# Altium schematic sheet main_board.SchDoc
size A3
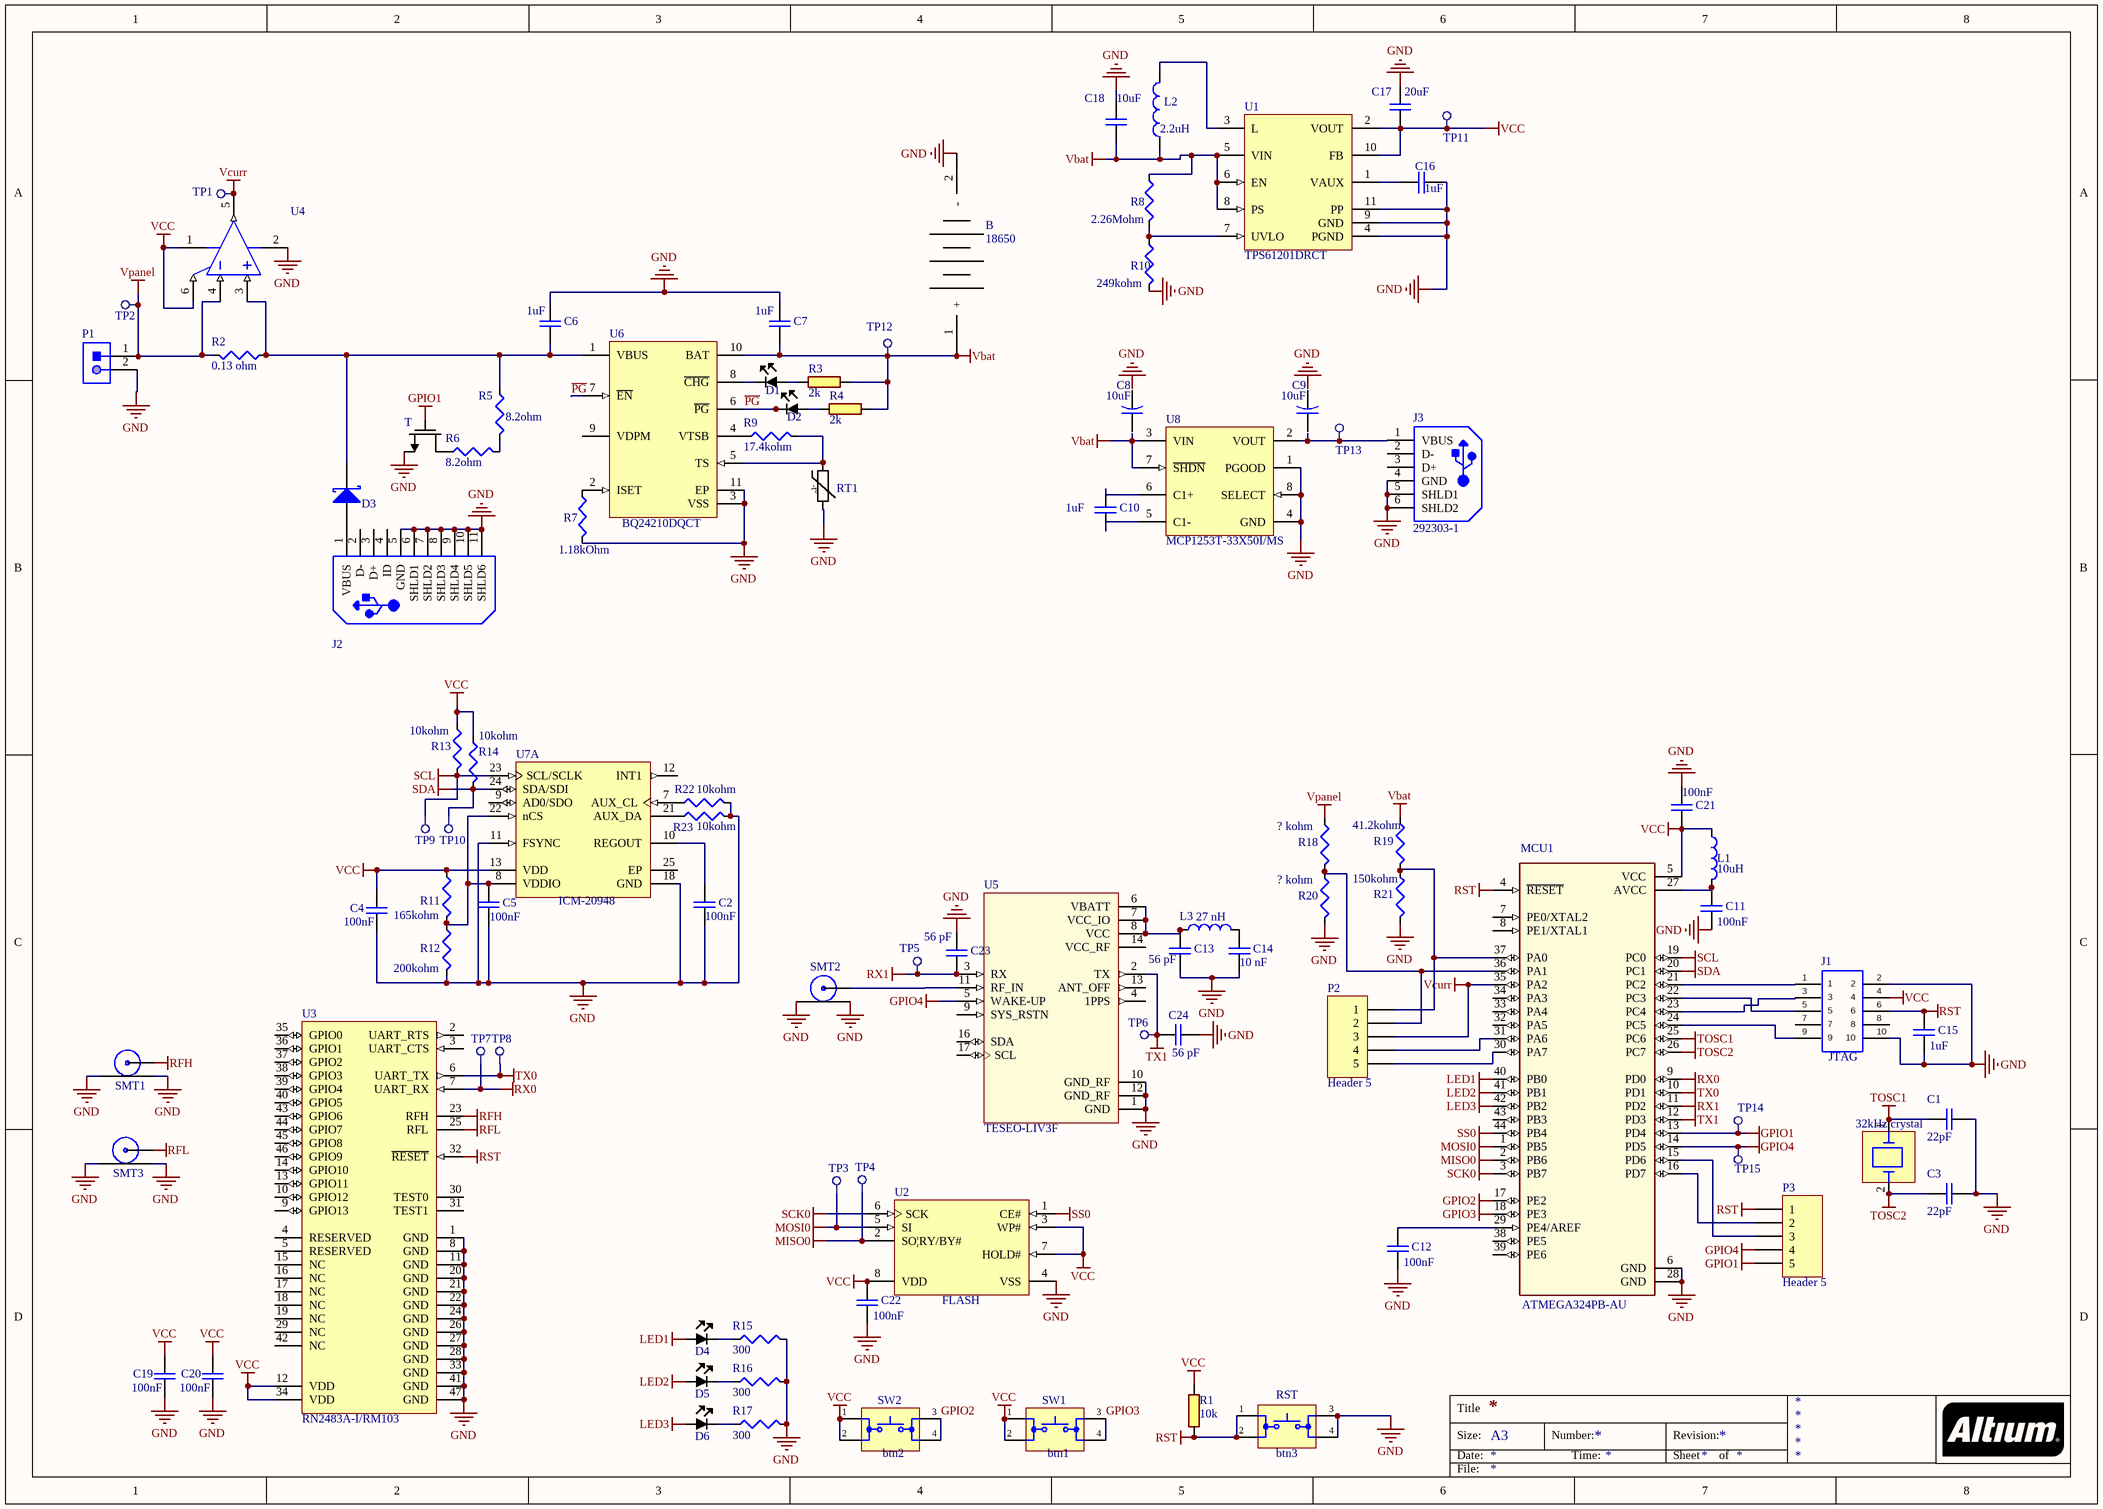
[diagram p0: main_board.SchDoc]

## Parts
B  18650  [18650]
btn1  Type: SW1  [KSC222G LFS]  (hidden comment: KSC222G LFS)
btn2  Type: SW2  [KSC222G LFS]  (hidden comment: KSC222G LFS)
btn3  Type: RST  [KSC222G LFS]  (hidden comment: KSC222G LFS)
C1  value 22pF  [C0402]  (hidden comment: 04023C103KAT2A)
C2  value 100nF  [C0402]  (hidden comment: 04023C103KAT2A)
C3  value 22pF  [C0402]  (hidden comment: 04023C103KAT2A)
C4  value 100nF  [C0402]  (hidden comment: 04023C103KAT2A)
C5  value 100nF  [C0402]  (hidden comment: 04023C103KAT2A)
C6  value 1uF  [C0402]  (hidden comment: 04023C103KAT2A)
C7  value 1uF  [C0402]  (hidden comment: 04023C103KAT2A)
C8  value 10uF  [C3528]  (hidden comment: TCJB106M016R0100)
C9  value 10uF  [C3528]  (hidden comment: TCJB106M016R0100)
C10  value 1uF  [C0402]  (hidden comment: 04023C103KAT2A)
C11  value 100nF  [C0402]  (hidden comment: 04023C103KAT2A)
C12  value 100nF  [C0402]  (hidden comment: 04023C103KAT2A)
C13  value 56 pF  [C0402]  (hidden comment: 04023C103KAT2A)
C14  value 10 nF  [C0402]  (hidden comment: 04023C103KAT2A)
C15  value 1uF  [C0402]  (hidden comment: 04023C103KAT2A)
C16  value 1uF  [C0402]  (hidden comment: 04023C103KAT2A)
C17  value 20uF  [C0402]  (hidden comment: 04023C103KAT2A)
C18  value 10uF  [C0402]  (hidden comment: 04023C103KAT2A)
C19  value 100nF  [C0402]  (hidden comment: 04023C103KAT2A)
C20  value 100nF  [C0402]  (hidden comment: 04023C103KAT2A)
C21  value 100nF  [C0402]  (hidden comment: 04023C103KAT2A)
C22  value 100nF  [C0402]  (hidden comment: 04023C103KAT2A)
C23  value 56 pF  [C0402]  (hidden comment: 04023C103KAT2A)
C24  value 56 pF  [C0402]  (hidden comment: 04023C103KAT2A)
D1  Green LED  [LED 0603]  (value not drawn)
D2  Green LED  [LED 0603]  (value not drawn)
D3  MBR0520L  [ONSC-SOD-123-2-425-04_V]  (value not drawn)
D4  Green LED  [LED 0603]  (value not drawn)
D5  Green LED  [LED 0603]  (value not drawn)
D6  Green LED  [LED 0603]  (value not drawn)
J1  Type: JTAG  [JTAG HEADER]  (hidden comment: SHF-105-01-L-D-SM)
J2  10118194-0001LF  [FCI-10118194-0001LF-5_V]  (value not drawn)
J3  292303-1  [TE-292303-1_V]
L1  value 10uH  [Inductor 0603]  (hidden comment: MLZ1608A2R2WT)
L2  Inductance: 2.2uH  [COIL-LPS3015_V]  (hidden comment: LPS3015-222MRB)
L3  value 27 nH  [INDUCTOR 0402]  (hidden comment: LQG15HN27NJ02D)
MCU1  ATMEGA324PB-AU  [*QFP80P1200X1200X120-44N]
P1  S2B-XH-A(LF)(SN)  [JST-S2B-XH-A(LF)(SN)_V]  (value not drawn)
P2  Header 5  [HDR1X5]
P3  Header 5  [HDR1X5]
R1  10k  [RESC0603(1608)_N]
R2  value 0.13 ohm  [R0402]  (hidden comment: CRCW04020000Z0ED)
R3  2k  [RESC0402(1005)_L]
R4  2k  [RESC0402(1005)_L]
R5  value 8.2ohm  [R6432]  (hidden comment: 35228R2JT)
R6  value 8.2ohm  [R6432]  (hidden comment: 35228R2JT)
R7  value 1.18kOhm  [R0402]  (hidden comment: CRCW04020000Z0ED)
R8  value 2.26Mohm  [R0402]  (hidden comment: CRCW04020000Z0ED)
R9  value 17.4kohm  [R0402]  (hidden comment: CRCW04020000Z0ED)
R10  value 249kohm  [R0402]  (hidden comment: CRCW04020000Z0ED)
R11  value 165kohm  [R0402]  (hidden comment: CRCW04020000Z0ED)
R12  value 200kohm  [R0402]  (hidden comment: CRCW04020000Z0ED)
R13  value 10kohm  [R0402]  (hidden comment: CRCW04020000Z0ED)
R14  value 10kohm  [R0402]  (hidden comment: CRCW04020000Z0ED)
R15  value 300  [R0402]  (hidden comment: CRCW04020000Z0ED)
R16  value 300  [R0402]  (hidden comment: CRCW04020000Z0ED)
R17  value 300  [R0402]  (hidden comment: CRCW04020000Z0ED)
R18  value ? kohm  [R0402]  (hidden comment: CRCW04020000Z0ED)
R19  value 41.2kohm  [R0402]  (hidden comment: CRCW04020000Z0ED)
R20  value ? kohm  [R0402]  (hidden comment: CRCW04020000Z0ED)
R21  value 150kohm  [R0402]  (hidden comment: CRCW04020000Z0ED)
R22  value 10kohm  [R0402]  (hidden comment: CRCW04020000Z0ED)
R23  value 10kohm  [R0402]  (hidden comment: CRCW04020000Z0ED)
RT1  B57164K0103J000  [B57164K0103J000]  (value not drawn)
SMT1  U.FL-R-SMT  [*U.FL-R-SMT_U.FL-R-SMT(Primary)]  (value not drawn)
SMT2  U.FL-R-SMT  [*U.FL-R-SMT_U.FL-R-SMT(Primary)]  (value not drawn)
SMT3  U.FL-R-SMT  [*U.FL-R-SMT_U.FL-R-SMT(Primary)]  (value not drawn)
T  DMG6968U  [DMG6968U]  (value not drawn)
TP1  Test point  [TEST POINT]  (value not drawn)
TP2  Test point  [TEST POINT]  (value not drawn)
TP3  Test point  [TEST POINT]  (value not drawn)
TP4  Test point  [TEST POINT]  (value not drawn)
TP5  Test point  [TEST POINT]  (value not drawn)
TP6  Test point  [TEST POINT]  (value not drawn)
TP7  Test point  [TEST POINT]  (value not drawn)
TP8  Test point  [TEST POINT]  (value not drawn)
TP9  Test point  [TEST POINT]  (value not drawn)
TP10  Test point  [TEST POINT]  (value not drawn)
TP11  Test point  [TEST POINT]  (value not drawn)
TP12  Test point  [TEST POINT]  (value not drawn)
TP13  Test point  [TEST POINT]  (value not drawn)
TP14  Test point  [TEST POINT]  (value not drawn)
TP15  Test point  [TEST POINT]  (value not drawn)
U1  TPS61201DRCT  [DRC0010J_V]
U2  Type: FLASH  [MCHP-SOIC-S2A8_L]  (hidden comment: SST25VF080B-50-4I-S2AF)
U3  RN2483A-I/RM103  [MCHP-MODULE-47_V]
U4  MAX44284FAUT+T  [MAXM-U6_V]  (value not drawn)
U5  TESEO-LIV3F  [*TESEO-LIV3F]
U6  BQ24210DQCT  [DQC0010A]
U7  ICM-20948  [TDK-QFN-24_L]  (part A of 2)
U8  MCP1253T-33X50I/MS  [MSOP-MS8_M]
Y1  9HT10-32.768KEZC-T  [9HT10-32.768KEZC-T]  (value not drawn)

## Nets
GND: B.2(-) btn3.3 btn3.4 C1.1 C2.1 C3.1 C4.1 C5.1 C6.2 C7.2 C8.2 C9.2 C11.1 C12.1 C13.1 C14.1 C15.1 C16.1 C17.2 C18.2 C19.1 C20.1 C21.2 C22.1 C23.2 C24.1 J1.2 J1.10 J2.5(GND) J2.6(SHLD1) J2.7(SHLD2) J2.8(SHLD3) J2.9(SHLD4) J2.10(SHLD5) J2.11(SHLD6) J3.4(GND) J3.5(SHLD1) J3.6(SHLD2) MCU1.6(GND) MCU1.28(GND) P1.2 R7.2 R10.2 R12.2 R15.2 R16.2 R17.2 R20.2 R21.2 R22.2 R23.2 RT1.1 SMT1.P$2 SMT1.P$3 SMT2.P$2 SMT2.P$3 SMT3.P$2 SMT3.P$3 T.2(S) U1.4(PGND) U1.9(GND) U1.11(PP) U2.4(VSS) U3.1(GND) U3.8(GND) U3.11(GND) U3.20(GND) U3.21(GND) U3.22(GND) U3.24(GND) U3.26(GND) U3.27(GND) U3.28(GND) U3.33(GND) U3.41(GND) U3.47(GND) U4.2(GND) U5.1(GND) U5.10(GND_RF) U5.12(GND_RF) U6.3(VSS) U6.11(EP) U7.11(FSYNC) U7.18(GND) U8.1(PGOOD) U8.4(GND) U8.8(SELECT)
GPIO1: MCU1.13(PD4) P3.5 T.1(G) TP14.1
GPIO2: btn2.3 btn2.4 MCU1.17(PE2)
GPIO3: btn1.3 btn1.4 MCU1.18(PE3)
GPIO4: MCU1.14(PD5) P3.4 TP15.1 U5.5(WAKE-UP)
LED1: D4.1 MCU1.40(PB0)
LED2: D5.1 MCU1.41(PB1)
LED3: D6.1 MCU1.42(PB2)
MISO0: MCU1.2(PB6) TP4.1 U2.2(SO|RY/BY#)
MOSI0: MCU1.1(PB5) TP3.1 U2.5(SI)
RFH: SMT1.P$1 U3.23(RFH)
RFL: SMT3.P$1 U3.25(RFL)
RST: btn3.1 btn3.2 C15.2 J1.6 MCU1.4(~{RESET}) P3.1 R1.1 U3.32(~{RESET})
RX0: MCU1.9(PD0) TP7.1 U3.7(UART_RX)
RX1: C23.1 MCU1.11(PD2) TP5.1 U5.3(RX)
SCK0: MCU1.3(PB7) U2.6(SCK)
SCL: MCU1.19(PC0) R13.2 TP9.1 U7.23(SCL/SCLK)
SDA: MCU1.20(PC1) R14.2 TP10.1 U7.24(SDA/SDI)
SS0: MCU1.44(PB4) U2.1(CE#)
TOSC1: C1.2 MCU1.25(PC6) Y1.1
TOSC2: C3.2 MCU1.26(PC7) Y1.2
TX0: MCU1.10(PD1) TP8.1 U3.6(UART_TX)
TX1: C24.2 MCU1.12(PD3) TP6.1 U5.2(TX)
Vbat: B.1(+) C7.1 C8.1 C18.1 L2.1 R3.2 R4.2 R8.1 R19.1 TP12.1 U1.5(VIN) U1.6(EN) U1.8(PS) U6.10(BAT) U8.3(VIN) U8.7(~{SHDN})
VCC: btn1.1 btn1.2 btn2.1 btn2.2 C4.2 C17.1 C19.2 C20.2 C21.1 C22.2 J1.4 L1.1 MCU1.5(VCC) R1.2 R11.1 R13.1 R14.1 TP11.1 U1.2(VOUT) U1.10(FB) U2.3(WP#) U2.7(HOLD#) U2.8(VDD) U3.12(VDD) U3.34(VDD) U4.1(VDD) U4.6(~{SHDN}) U7.13(VDD)
Vcurr: MCU1.35(PA2) P2.3 TP1.1 U4.5(OUT)
Vpanel: P1.1 R2.2 R18.1 TP2.1 U4.4(RS-)
~{PG}: D2.2 U6.6(~{PG}) U6.7(~{EN})
NetC2_2: C2.2 U7.10(REGOUT)
NetC5_2: C5.2 R11.2 R12.1 U7.8(VDDIO) U7.22(nCS)
NetC6_1: C6.1 D3.1(K) R2.1 R5.1 U4.3(RS+) U6.1(VBUS)
NetC9_1: C9.1 J3.1(VBUS) TP13.1 U8.2(VOUT)
NetC10_1: C10.1 U8.5(C1-)
NetC10_2: C10.2 U8.6(C1+)
NetC11_2: C11.2 L1.2 MCU1.27(AVCC)
NetC12_2: C12.2 MCU1.29(PE4/AREF)
NetC13_2: C13.2 L3.1 U5.6(VBATT) U5.7(VCC_IO) U5.8(VCC)
NetC14_2: C14.2 L3.2
NetC16_2: C16.2 U1.1(VAUX)
NetD1_1: D1.1 R3.1
NetD1_2: D1.2 U6.8(~{CHG})
NetD2_1: D2.1 R4.1
NetD3_2: D3.2(A) J2.1(VBUS)
NetD4_2: D4.2 R15.1
NetD5_2: D5.2 R16.1
NetD6_2: D6.2 R17.1
NetJ1_1: J1.1 MCU1.21(PC2)
NetJ1_3: J1.3 MCU1.23(PC4)
NetJ1_5: J1.5 MCU1.22(PC3)
NetJ1_9: J1.9 MCU1.24(PC5)
NetL2_2: L2.2 U1.3(L)
NetMCU1_15: MCU1.15(PD6) P3.3
NetMCU1_16: MCU1.16(PD7) P3.2
NetMCU1_30: MCU1.30(PA7) P2.5
NetMCU1_31: MCU1.31(PA6) P2.4
NetMCU1_36: MCU1.36(PA1) P2.2 R18.2 R20.1
NetMCU1_37: MCU1.37(PA0) P2.1 R19.2 R21.1
NetR5_2: R5.2 R6.2
NetR6_1: R6.1 T.3(D)
NetR7_1: R7.1 U6.2(ISET)
NetR8_2: R8.2 R10.1 U1.7(UVLO)
NetR9_1: R9.1 U6.4(VTSB)
NetR9_2: R9.2 RT1.2 U6.5(TS)
NetR22_1: R22.1 U7.7(AUX_CL)
NetR23_1: R23.1 U7.21(AUX_DA)
NetSMT2_P$1: SMT2.P$1 U5.11(RF_IN)

Not connected (* = marked no-connect by the designer): J1 7 8; J2 2(D-) 3(D+) 4(ID); J3 2(D-) 3(D+); MCU1 7(PE0/XTAL2) 8(PE1/XTAL1) 32(PA5) 33(PA4) 34(PA3) 38(PE5) 39(PE6) 43(PB3); U3 2(UART_RTS) 3(UART_CTS) 4(RESERVED) 5(RESERVED) 9(GPIO13) 10(GPIO12) 13(GPIO11) 14(GPIO10) 15(NC) 16(NC) 17(NC) 18(NC) 19(NC) 29(NC) 30(TEST0) 31(TEST1) 35(GPIO0) 36(GPIO1) 37(GPIO2) 38(GPIO3) 39(GPIO4) 40(GPIO5) 42(NC) 43(GPIO6) 44(GPIO7) 45(GPIO8) 46(GPIO9); U5 4(1PPS) 9(SYS_RSTN) 13(ANT_OFF) 14(VCC_RF) 16(SDA) 17(SCL); U6 9(VDPM); U7 9(AD0/SDO) 12(INT1) 25(EP)

## Notes on the sheet
- 32kHz crystal
- Title
- Size:
- Date:
- A3
- Number:
- Time:
- Revision:
- Sheet
- of
- File:
- (in symbol B57164K0103J000) -t°

## Library data of the parts
btn1-btn3 = KSC222G LFS: Button SMD
C1-C7 C10-C24 = 04023C103KAT2A: C0402
C8 C9 = TCJB106M016R0100: C3528, low ESR (0.1ohm)
D1 D2 D4-D6 = Green LED: LED, green, 0603, 2mA, 2.65V, SMD
D3 = CMP-2000-04926-1: Schottky Diode, 20V, 0.2A, 2-pin SOD-123, RoHS, Tape and Reel; Manufacturer: FairchildSemiconductor; Peak Forward Voltage: 0.385V; Rad Hard: No; Peak Non-Repetitive Surge Current: 5.5A; Peak Average Forward Current: 0.5A; Peak Reverse Current: 250uA; Configuration: Single; Mounting: SurfaceMount; Operating Temperature: -65to125degC; Datasheet URL: https://datasheet.ciiva.com/5739/1684450-5739282.pdf; Package Reference: SOD-123-2-425-04; Package Description: 2-Pin Small Outline Diode, Body 2.69 x 1.6 mm; Type: SchottkyDiode; Datasheet Version: Rev. C0, 03/2012; Manufacturer URL: https://www.fairchildsemi.com/; Peak Reverse Repetitive Voltage: 20V; Package: 2SOD-123; Packaging: Tape&Reel; Category: Rectifier
J1 = SHF-105-01-L-D-SM: JTAG, 10 pin, 1.27mm
J2 = CMP-2000-05120-1: Micro USB B Type Receptacle, 1.8 A, -55 to 85 degC, 5-Pin SMD, RoHS, Tape and Reel; Manufacturer: Amphenol FCI; Body Orientation: RightAngle; Number of Contacts: 5; Pitch: 0.65mm; Gender: RCP; Rad Hard: No; Package Reference: 10118194-0001LF-5; Mounting: SurfaceMount; Manufacturer URL: http://www.fci.com/; Packaging: CutTape; Datasheet URL: https://datasheet.ciiva.com/26945/getdatasheetpartid-418619-26945695.pdf; Termination Method: Solder; Package Description: 5-Pin Surface Mount Device, Body 8.05 x 5.53 mm, Pitch 0.65 mm; Type: MicroUSBTypeB; Datasheet Version: Rev. A, 10/2011
J3 = CMP-2000-05404-1: 1 Port Right Angle Through Hole Mount Female Type A USB Connector, 4 Position, -55 to 85 degC, RoHS, Tube; Manufacturer: TE Connectivity; Contact Termination Type: Solder; No. of Contacts: 4; Connector Mounting: PCB; SVHC: NoSVHC(16-Jun-2014); Gender: Receptacle; Connector Type: USBA; Package Description: 4-Pin Through Hole Device, Body 14 x 13.13 mm, Pitch 2.5 mm; Contact Plating: Gold; Package Reference: 292303-1; Contact Material: Copper; Datasheet URL: http://www.farnell.com/cad/1653030.pdf; Datasheet Version: Feb-12; Manufacturer URL: http://www.te.com/
L1 = MLZ1608A2R2WT: Inductor 0603
L2 = CMP-2000-06574-1: Shielded Power Inductor, 2.2 uH, +/- 20%, 110 mOhm, -40 to 85 degC, 2-Pin SMD, RoHS, Tape and Reel; Core Material: Ferrite; Qualification: AEC-Q200; Unit Weight: 0.001411oz; Maximum DC Resistance: 110mOhms; Maximum DC Current: 2.1A; Brand: Coilcraft; Test Frequency: 100kHz; Self Resonant Frequency: 110MHz; Width: 3mm; Datasheet URL: http://www.coilcraft.com/pdfs/lps3015.pdf; Series: LPS3015; Termination Style: SMD/SMT; Length: 3mm; Height: 1.4mm; Manufacturer: Coilcraft; Type: ShieldedPowerInductor; Package Reference: LPS3015; Mounting Style: SMD/SMT; RoHS: True; Tolerance: 20%; Product Category: FixedInductors; Datasheet Version: 09/2015; Manufacturer URL: http://www.coilcraft.com/; Packaging: CutTape; Operating Temperature Range: -40Cto+85C; Factory Pack Quantity: 1; Mounting Technology: SurfaceMount; Product: PowerInductors; Package Description: 2-Pin Surfave Mount Device, Body 2.95 x 2.95 mm; Shielding: Shielded
L3 = LQG15HN27NJ02D: Inductor 0402
MCU1 = ATMEGA324PB-AU: Avr, 32kb Flash, 1kb Ee, 2kb Ram - 20mhz, Tqfp, Ind Temp, Green 5 v/ Tqfp _a_; MF: Microchip; Package: TQFP-44 Microchip; MP: ATMEGA324PB-AU; SnapEDA_Link: https://www.snapeda.com/parts/ATMEGA324PB-AU/Microchip/view-part/?ref=snap; Availability: Unavailable; Price: None; Value: *
P1 = CMP-1755-00005-1: Male Header, Pitch 2.5 mm, 1 x 2 Position, Height 6.1 mm, Tail Length 3.4 mm, -25 to 85 degC, RoHS, Bulk; Type (Capacitors): X7R; Voltage Rating (DC): 100 V; Tolerance: 10%; Capacitance: 1 nF; Case\Package: Radial; Min Operating Temperature: -55 degC; Mount: Through Hole; Package Quantity: 500; PackageReference: S2B-XH-A(LF)(SN); ComponentLink1Description: Manufacturer URL; Max Operating Temperature: 125 degC; ComponentLink2Description: Datasheet; RoHSCompliant: true; PackageDescription: Male Header, Pitch 2.5 mm, 1 x 2 Position, Height 6.1 mm, Tail Length 3.4 mm; REACH SVHC: No SVHC; Packaging: Bulk; Width: 3.81 mm; Length: 5.33 mm; Height: 2.54 mm; Pins: 2; Radiation Hardening: No; ComponentLink1URL: http://www.jst.com/home2.html; Lead Pitch: 2.54 mm; DatasheetVersion: May-16; Voltage Rating: 100 V; ComponentLink2URL: http://www.jst-mfg.com/product/pdf/eng/eXH.pdf
P2 P3 = Header 5: Header, 5-Pin; LatestRevisionDate: 17-Jul-2002; LatestRevisionNote: Re-released for DXP Platform.; Publisher: Altium Limited
R1 = 5264: 0.1W 1% Thick film resistor; id: 5264; rad: 1; rom: OV; lager_type: Baklager; dybde: 3; hylle: 6; antall: 1200; pakke_opprettet_av: 815; leverandor_varenr: 2447230; pris: 0; nokkelord: Resistor Motstand; produsent: Multikomp; leverandor: Farnell; pakketype: 0603; pakke_opprettet: 08.07.2014 21:15:30; symbol_opprettet_av: 815; symbol_opprettet: 08.07.2014 21:16:33; navn: 10k; komponenttype: 1
R2 R7-R23 = CRCW04020000Z0ED: R0402
R3 R4 = 5677: 0.1W 1% Thick film resistor; id: 5677; pakke_opprettet_av: 1855; symbol_opprettet_av: 815; navn: 56k; pris: 0; pakketype: 0402; komponenttype: 1; pakke_opprettet: 12.05.2019 22:25:28; symbol_opprettet: 08.07.2014 21:16:33
R5 R6 = 35228R2JT: R6432, 3W
RT1 = B57164K0103J000: Thermistor, through hole
SMT1-SMT3 = U.FL-R-SMT: MF: Hirose Electric; MP: U.FL-R-SMT; Package: None; Price: None; Availability: Unavailable; SnapEDA_Link: https://www.snapeda.com/parts/U.FL-R-SMT/Hirose%20Electric%20Co%20Ltd/view-part/?ref=snap; Value: *
T = DMG6968U: NMOS 6.5A 500mV; Threshold voltage: 500mV; Cont. drain current: 6.5A; Supplier Part Number 1: 1843757; Supplier 1: Farnell
U1 = CMP-0343-00033-2: Boost Voltage Converter with 0.3 to 5.5 V Input and 3.3 V Output, -40 to 85 degC, 10-Pin SON (DRC), Green (RoHS & no Sb/Br); Manufacturer: Texas Instruments; Switching Frequency(Max)(kHz): 1250; Vin(Min)(V): 0.3; Preset Vout(V): 3.3; Vin(Max)(V): 5.5; Regulated Outputs(#): 1; Synchronous Rectification: TRUE; SubFamily: Step-Up Regulator; ComponentLink2Description: Package Specification; PackageVersion: revL, Sep-2011; DatasheetVersion: SLVS577B; PackageReference: DRC0010J; PackageDescription: 10-Pin Plastic Small Outline No-Lead, 3 x 3 x 1 mm Body, 0.5 mm Pitch, Exposed Pad; Vout(Min)(V): 3.3; ComponentLink1URL: http://www.ti.com/general/docs/lit/getliterature.tsp?genericPartNumber=TPS61201&fileType=pdf; ComponentLink1Description: Datasheet; Topology: Boost; Mounting Technology: Surface Mount; ComponentLink2URL: http://www.ti.com/litv/pdf/mpds117k; PartNumber: TPS61201DRCT; Eco-Plan: Green (RoHS & no Sb/Br); Vout(Max)(V): 3.3
U2 = CMP-0378-00062-1: 8 Mbit SPI Serial Flash, 2.7 to 3.6 V, 50 MHz, -40 to 85 degC, 8-pin SOIC (S2A8), Tube; Manufacturer: Microchip; DatasheetVersion: Rev. A; Mounting Technology: Surface Mount; PackageVersion: Rev. A; PackageDescription: 8-Lead Plastic Small Outline Intergrated Circuit, 5.275 x 5.275 mm Body, 1.27 mm Pitch; ComponentLink1URL: http://www.microchip.com; ComponentLink4Description: Product URL; ComponentLink2URL: http://ww1.microchip.com/downloads/en/DeviceDoc/25045A.pdf; ComponentLink3Description: Package Specification; PackageReference: SOIC-S2A8; ComponentLink4URL: http://www.microchip.com/SST25VF080B; ComponentLink2Description: Datasheet; ComponentLink1Description: Manufacturer URL; PartNumber: SST25VF080B-50-4I-S2AF; ComponentLink3URL: http://ww1.microchip.com/downloads/en/DeviceDoc/25051A.pdf
U3 = CMP-2000-07478-1: Low-Power Long Range LoRa(R) Technology Transceiver Module, 2.1 to 3.6 V, -40 to 85 degC, 47-Pin SMD, RoHS, Tray; Manufacturer: Microchip; Datasheet URL: http://www.microchip.com/mymicrochip/filehandler.aspx?ddocname=en574289; Package Description: 47-Pin Surface Mount Device, Body 26.67 x 17.78 mm, Pitch 1.27 mm; Package Reference: MODULE-47; RoHSCompliant: false; Mounting Technology: SurfaceMount; Datasheet Version: Rev. C, 04/2017; Manufacturer URL: http://www.microchip.com/
U4 = CMP-2000-06663-1: Input Common-Mode, High-Precision, Low-Power Current-Sense Amplifier, 3 KHz, 2 nA, 1.7 to 5.5 V, -40 to 125 degC, 6-Pin SOT23 (U6+1), RoHS, Tape and Reel; Manufacturer: Maxim; Number of Circuits: 1; Voltage - Supply, Single/Dual (±): 1.7V~5.5V; Current - Input Bias: 2nA; -3db Bandwidth: 3kHz; Current - Supply: 21µA; Amplifier Type: CurrentSense; Voltage - Input Offset: 2µV; Datasheet URL: https://datasheets.maximintegrated.com/en/ds/MAX44284.pdf; Category: IntegratedCircuits(ICs); Family: Linear-Amplifiers-Instrumentation,OPAmps,BufferAmps; Package Description: 6-Pin Small Outline Transistor, Body 2.9 x 1.625 mm, Pitch 0.95 mm; Mounting Technology: SurfaceMount; Supplier Device Package: 6-SOT; Package Reference: U6+1; Manufacturer URL: http://www.maximintegrated.com/; Package / Case: SOT-6; Operating Temperature: -40°C~125°C; Datasheet Version: Rev. 4, 01/2015; Packaging: Tape&Reel(TR); Standard Package: 2,500; Mounting Type: SurfaceMount; Package URL: http://pdfserv.maximintegrated.com/package_dwgs/21-0058.PDF
U5 = TESEO-LIV3F: - RF Receiver BeiDou, Galileo, GLONASS, GNSS, GPS 1.575GHz -163dBm 18-LCC _9.7x10.1_; MF: STMicroelectronics; SnapEDA_Link: https://www.snapeda.com/parts/TESEO-LIV3F/STMicroelectronics/view-part/1474256/?ref=snap; Package: SMD-18 STMicroelectronics; MP: TESEO-LIV3F; Price: None; Availability: Unavailable; Value: *
U6 = CMP-0321-00481-2: 800 mA, Single-Input, Single Cell Li-Ion Solar Battery Charger, 3.5 V, -40 to 85 degC, 10-pin WSON (DQC), Green (RoHS & no Sb/Br); Manufacturer: Texas Instruments; Lead Acid: N; Vin(Min)(V): 3.5; SubFamily: Battery Charge Management; PartNumber: BQ24210DQCT; DatasheetVersion: SLUSA76A; ComponentLink1Description: Datasheet; Eco-Plan: Green (RoHS & no Sb/Br); PackageVersion: revA, Jul-2008; Over Voltage Protection: N; ComponentLink1URL: http://www.ti.com/general/docs/lit/getliterature.tsp?genericPartNumber=BQ24210&fileType=pdf; PackageDescription: 10-Pin Plastic Small Outline No-Lead, 2 x 3 x 0.8 mm Body, 0.5 mm Pitch, Exposed Pad; Li-Polymer: N; PackageReference: DQC0010A; NiCd: N; NiMH: N; Li-Ion: N; Mounting Technology: Surface Mount
U7 = CMP-2000-07532-1: World’s Lowest Power 9-Axis MEMS MotionTracking(TM) Device, 1.71 to 3.6 V, -40 to 85 degC, 24-Pin QFN, RoHS, Tape and Reel; Manufacturer: TDK; Package Description: 24-Pin Quad Flat No-lead Package, Body 3 x 3 mm, Pitch 0.4 mm; Datasheet Version: Rev. 1.3, 06/2017; Package Reference: QFN-24; Mounting Technology: SurfaceMount; Datasheet URL: https://www.invensense.com/wp-content/uploads/2016/06/DS-000189-ICM-20948-v1.3.pdf; Manufacturer URL: http://www.tdk.com/
U8 = CMP-0132-00083-1: Low Noise, Positive-Regulated Charge Pump, 1MHz, Fixed Output, 8-Pin MSOP, Industrial Temperature, Tape and Reel; PackageReference: MSOP-MS8; PackageDescription: 8-Lead Plastic Micro Small Outline Package (MS) [MSOP]; DatasheetVersion: revA, Nov-2002; PackageVersion: revBB, Aug-2009
Y1 = 9HT10-32.768KEZC-T: Crystal 32.768kHz, SMD, 3.2mm x 1.5mm, 9pF, 10 ppm
TP1-TP15 = Test point: Type: I2C/SCL